# EAGLE design xtree (EAGLE 7.1.0)
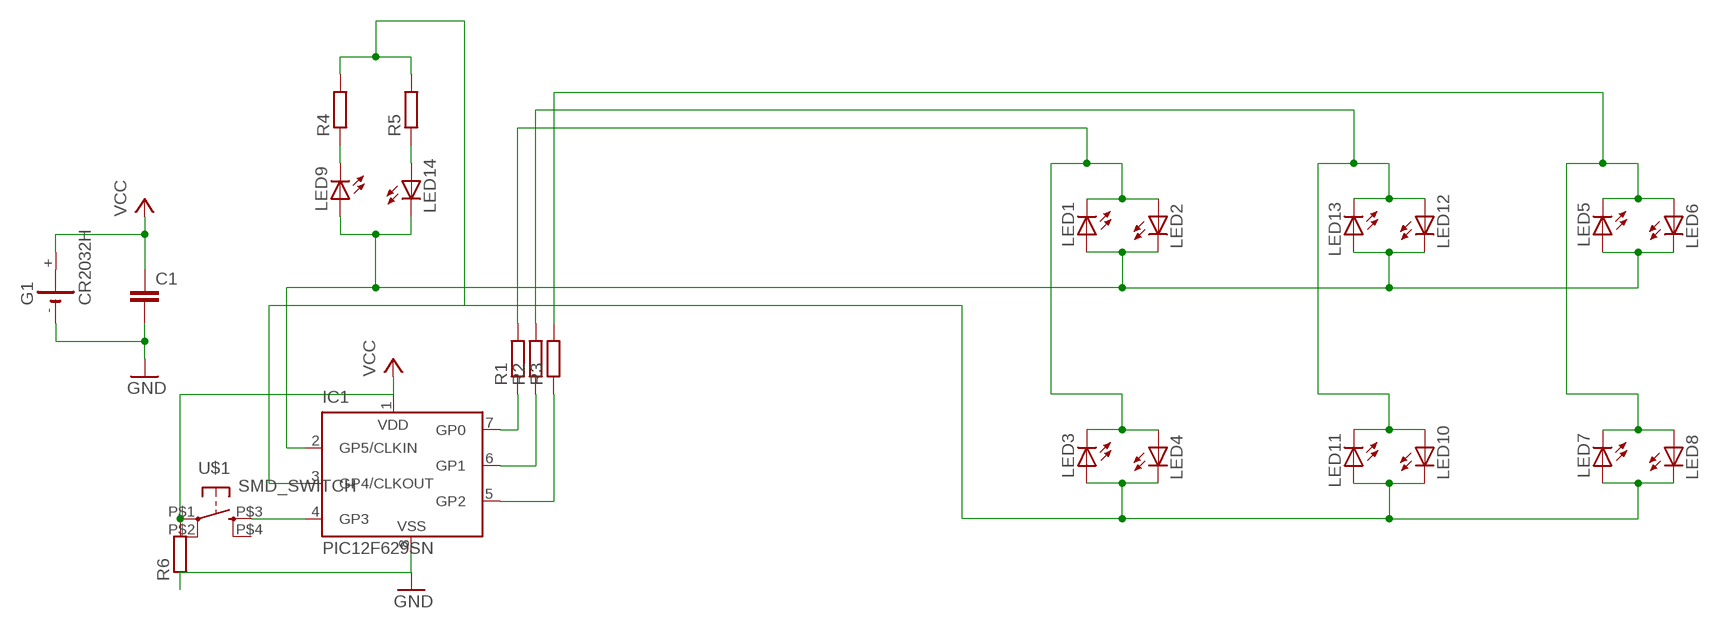
[diagram p0: schematic, sheet 1]

## Parts
C1  C-EUC1206K  [C1206K]
G1  CR2032H  [CR2032H]
IC1  PIC12F629SN  [SO-08]
LED1  LED_E  [LED_1206]
LED2  LED_E  [LED_1206]
LED3  LED_E  [LED_1206]
LED4  LED_E  [LED_1206]
LED5  LED_E  [LED_1206]
LED6  LED_E  [LED_1206]
LED7  LED_E  [LED_1206]
LED8  LED_E  [LED_1206]
LED9  LED_E  [LED_1206]
LED10  LED_E  [LED_1206]
LED11  LED_E  [LED_1206]
LED12  LED_E  [LED_1206]
LED13  LED_E  [LED_1206]
LED14  LED_E  [LED_1206]
R1  R-EU_R0603  [R0603]
R2  R-EU_R0603  [R0603]
R3  R-EU_R0603  [R0603]
R4  R-EU_R0603  [R0603]
R5  R-EU_R0603  [R0603]
R6  R-EU_R0603  [R0603]
U$1  SMD_SWITCH  [SMD_BUTTON]

## Nets
GND: C1.2 G1.- IC1.8(VSS) R6.1
N$1: LED1.C LED2.A LED3.C LED4.A R1.2
N$2: IC1.3(GP4/CLKOUT) LED3.A LED4.C LED7.A LED8.C LED10.C LED11.A R4.2 R5.2
N$3: IC1.7(GP0) R1.1
N$4: LED5.C LED6.A LED7.C LED8.A R3.2
N$5: LED10.A LED11.C LED12.A LED13.C R2.2
N$6: IC1.2(GP5/CLKIN) LED1.A LED2.C LED5.A LED6.C LED9.A LED12.C LED13.A LED14.C
N$7: IC1.6(GP1) R2.1
N$8: IC1.5(GP2) R3.1
N$9: IC1.4(GP3) U$1.P$3(S)
N$11: LED9.C R4.1
N$12: LED14.A R5.1
VCC: C1.1 G1.+ IC1.1(VDD) R6.2 U$1.P$1(P)
Unconnected: G1.+@1(+) U$1.P$2(P1) U$1.P$4(S1)

## Library data of the parts
C1 = rcl:C-EU: CAPACITOR, European symbol
G1 = battery:CR2032H: LI BATTERY Varta
IC1 = microchip:PIC12F6*: Data Sheet 8-Pin FLASH-Based 8-Bit CMOS Microcontrollers Source: http://www.microchip.com .. 41190c.pdf; MF: MICROCHIP; MPN: PIC12F629-I/SN; OC_FARNELL: 9759000; OC_NEWARK: 61K3433
LED1-LED14 = eagle-ltspice:LED_E: LED Source: http://www.osram.convergy.de Source: www.luxeon.com Source: www.kingbright.com; SPICEMODEL: NONE; SPICEPREFIX: D; SPICETYPE: diode
R1-R6 = rcl:R-EU_: RESISTOR, European symbol
U$1 = smd_button:SMD_SWITCH

## Board
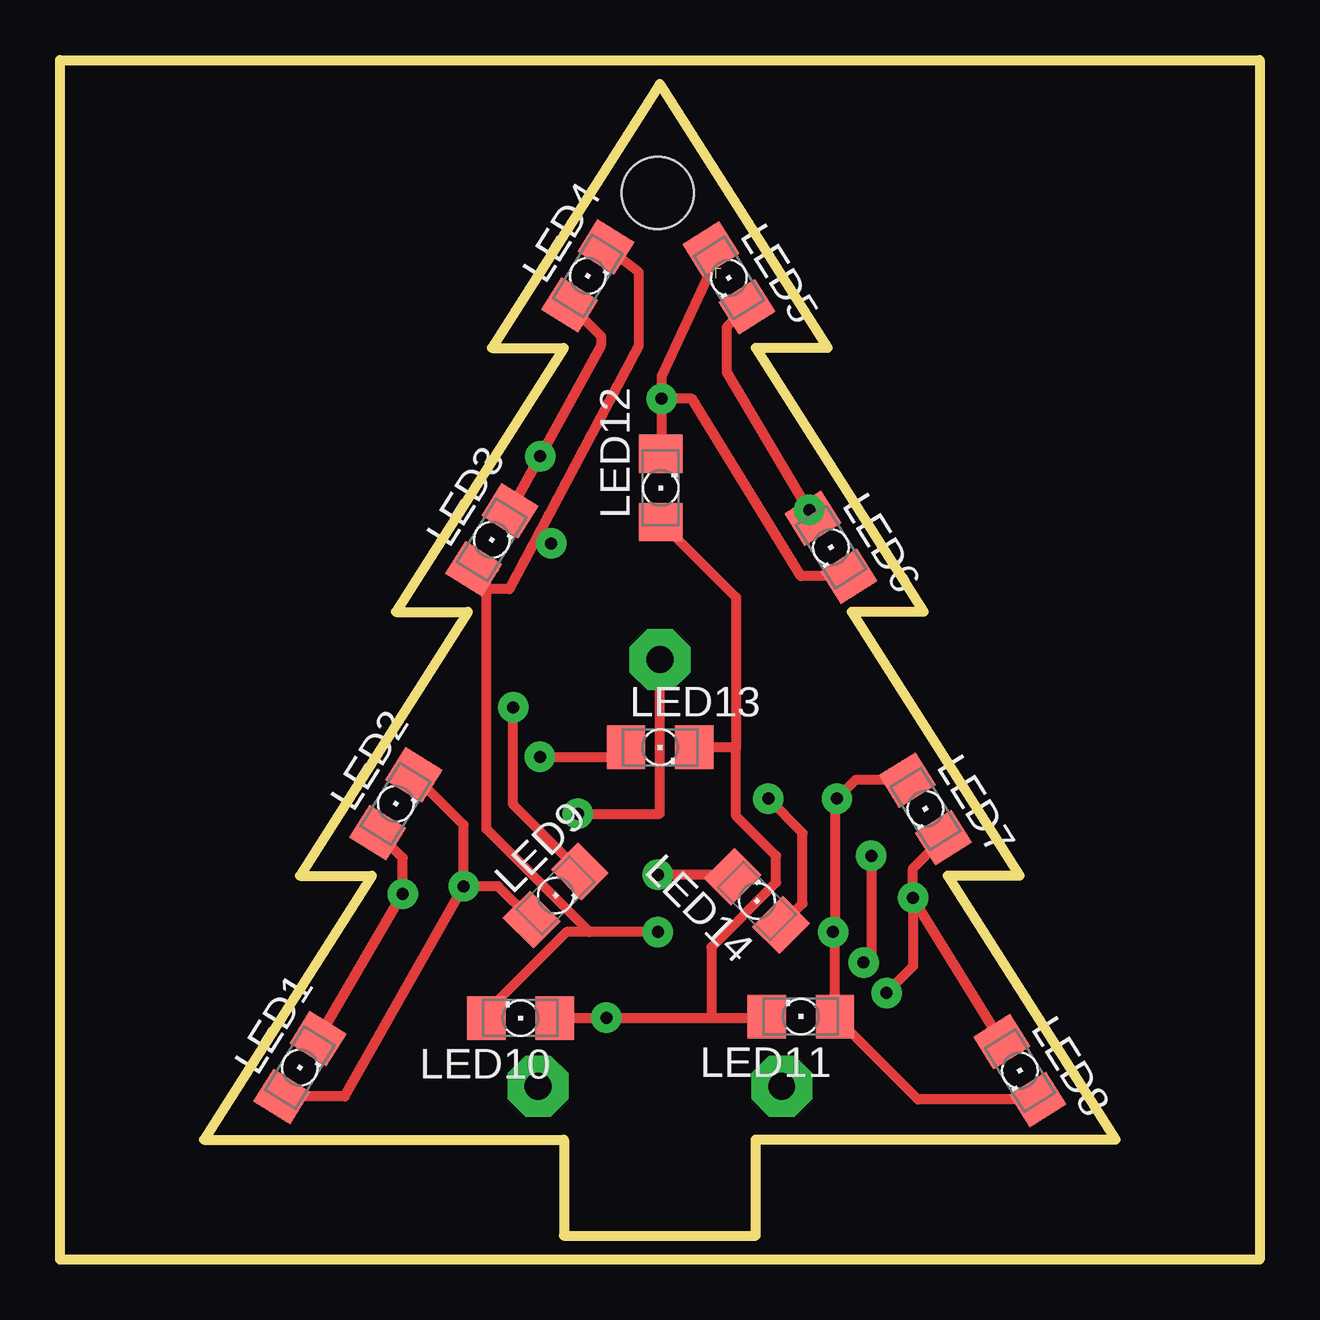
[diagram p1: board, top side]
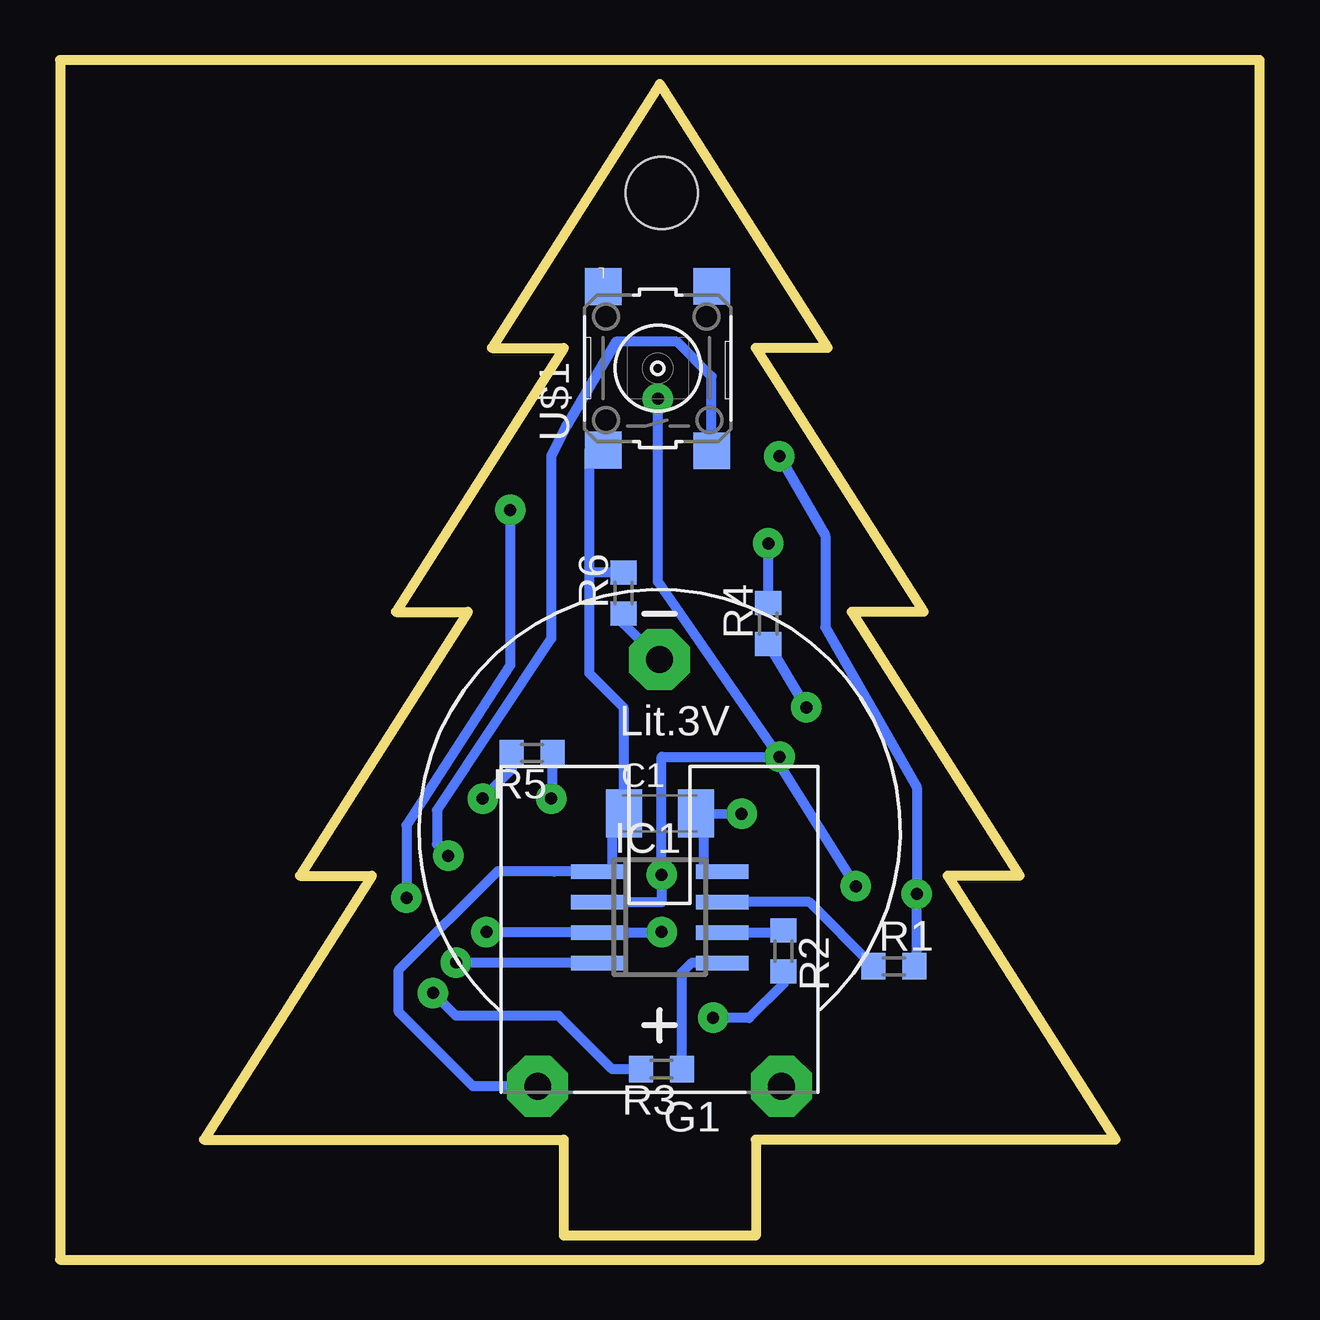
[diagram p2: board, bottom side, seen from below]

Size 50 x 50 mm. Coordinates in mm from the lower left corner, seen from the top.
Outline: 0,0 0,50 50,50 50,0 0,0
Outline: 18,38 21,38 14,27 17,27 10,16 13,16 6,5 21,5 21,1 29,1 29,5 44,5 37,16 40,16 33,27 36,27 29,38 32,38 25,49 18,38
Copper layers (1*16): Top 0.035mm / dielectric 1.5mm / Bottom 0.035mm
Design rules "default": minimum track width 10mil, minimum drill 24mil, track to track 8mil, track to pad 8mil, pad to pad 8mil, via to via 8mil, smd to smd 8mil, copper to edge 40mil, drill to drill 8mil, minimum pad ring 10mil, minimum via ring 8mil, stop-mask expansion 4mil, vias tented up to drill 0mil, thermal gap 10mil
Holes 3 mm at 24.92,44.45

### Footprints (pad centres in the part's own frame; a part is rotated, then mirrored left to right if it is on the bottom)
C1206K = smd 1.5 x 2: 1 -1.5,0; 2 1.5,0
CR2032H = drill 1.118 pad 2.54 octagon: + 5.08,10.795; +@1 -5.08,10.795; - 0,-6.985
SO-08 = smd 0.6 x 2.2: 1 -1.905,-2.6; 2 -0.635,-2.6; 3 0.635,-2.6; 4 1.905,-2.6; 5 1.905,2.6; 6 0.635,2.6; 7 -0.635,2.6; 8 -1.905,2.6
LED_1206 = smd 1.6 x 1.803: A -1.422,0; C 1.422,0
R0603 = smd 1 x 1.1: 1 -0.85,0; 2 0.85,0
SMD_BUTTON = smd 1.524 x 1.524: P$1 -3.407,2.272; P$2 3.406,2.266; P$3 -3.431,-2.244; P$4 3.412,-2.256

### Placement (x,y rotation side)
C1  25,18.59 0 bottom
G1  25.01,18.02 180 bottom
IC1  25,14.27 270 bottom
LED1  10,8 58 top
LED2  14,18.99 58 top
LED3  18,30 58 top
LED4  22,41 58 top
LED5  27.88,40.91 302 top
LED6  32.13,29.69 302 top
LED7  36.07,18.78 302 top
LED8  40.01,7.88 302 top
LED9  20.66,15.17 45 top
LED10  19.2,10.07 180 top
LED11  30.88,10.13 180 top
LED12  25.04,32.16 90 top
LED13  25.02,21.35 0 top
LED14  29.05,14.95 135 top
R1  15.24,12.22 0 bottom
R2  19.84,12.86 270 bottom
R3  24.92,7.94 180 bottom
R4  20.48,26.51 90 bottom
R5  30.32,21.11 180 bottom
R6  26.51,27.78 90 bottom
U$1  25.08,37.15 90 bottom

### Tracks (layer width: path | path; a pad name or v marks a point on that pad's centre or on a via)
GND  (via drill 0.5 pad 1.27)
  Top 0.406: G1.- 25.01,18.59 25,18.57 v21.59,18.57
  Bottom 0.406: IC1.8 23,16.17 23.18,16.35 23.18,18.26 C1.2 23.35,18.59 v21.59,18.57 | R6.1 26.51,26.51 G1.-
N$1  (via drill 0.5 pad 1.27)
  Top 0.406: LED4.A 22.54,38.5 22.54,38.1 LED3.C | LED1.C v14.29,15.24 14.29,16.74 LED2.A | LED3.C 18.88,31.34 18.88,31.53 | LED3.C v20.01,33.48
  Bottom 0.406: v20.02,33.49 19.95,33.37 | 19.95,33.37 18.1,30.16 18.1,26.35 14.29,19.68 v14.29,15.24 14.29,12.33 R1.2 | v20.01,33.48 19.95,33.37
N$2  (via drill 0.5 pad 1.27)
  Top 0.406: 17.25,28.26 LED3.A 18.1,28.79 | 17.25,28.26 17.25,28.16 | 19.9,30.13 18.73,27.94 17.78,27.94 | 19.9,30.13 24.13,38.1 24.13,41.15 LED4.C | LED8.C 35.76,6.67 LED11.A 32.3,13.73 | LED10.C 17.77,9.53 18.1,9.53 18.1,10.64 21.11,13.65 22.07,13.65 | 32.3,13.73 32.3,19.13 v32.38,19.21 33.18,20 35.3,20 LED7.A | 32.3,13.73 v32.23,13.65 | v24.92,13.65 22.07,13.65 | 22.07,13.65 17.78,17.94 17.78,27.94 | 17.78,27.94 17.78,28.26 17.25,28.26 | v20.48,29.84 19.9,30.13
  Bottom 0.406: v24.92,13.65 24.94,13.63 IC1.3 32.25,13.63 | 32.3,13.65 32.28,13.63 32.25,13.63 | 32.25,13.63 v32.23,13.65 | R4.2 v20.48,29.84 | v32.38,19.21 31.17,20.42 R5.2
N$3
  Bottom 0.406: R1.1 18.77,14.9 IC1.7
N$4  (via drill 0.5 pad 1.27)
  Top 0.406: LED5.C 27.78,38.86 27.78,36.99 LED6.A v31.23,31.24 | LED8.A v35.56,15.08 | v35.56,15.08 35.56,16.31 LED7.C | v35.56,15.08 35.56,12.22 v34.45,11.11
  Bottom 0.406: v31.23,31.24 31.23,24.77 35.56,18.1 v35.56,15.08 | R3.2 26.99,7.94 29.21,10.16 33.5,10.16 v34.45,11.11
N$5  (via drill 0.5 pad 1.27)
  Top 0.406: 26.44,20.64 LED13.C 28.18,21.35 | LED12.A 28.18,27.6 28.18,21.35 | 29.69,10.36 LED11.C 29.46,10.08 27.15,10.08 | 27.15,10.08 v22.77,10.08 22.77,10.07 LED10.A | 27.15,10.08 27.15,13.02 29.84,15.72 29.84,16.83 28.18,18.49 28.18,21.35
  Bottom 0.406: 22.77,10.07 v22.77,10.08 22.76,10.07 21.27,10.07 19.84,11.49 R2.2
N$6  (via drill 0.5 pad 1.27)
  Top 0.406: LED1.A 11.87,6.79 v16.83,15.56 | LED6.C 30.89,28.48 26.35,35.88 v25.08,35.88 | v16.83,15.56 16.83,18.12 LED2.C | LED5.A 26.99,40.96 25.08,36.83 v25.08,35.88 | v25.08,35.88 25.08,33.58 LED12.C 25.04,33.7 24.77,33.97 | 23.5,21.1 23.35,20.95 LED13.A 23.59,20.95 v20,20.95 | LED14.C 27.97,16.03 v24.92,16.03 | LED9.A 18.27,15.56 v16.83,15.56
  Bottom 0.406: v16.83,15.56 20,20.64 v20,20.95 | v25.08,35.88 25.08,28.26 v20,20.95 | IC1.2 24.92,14.9 v24.92,16.03 24.92,20.95 v20,20.95
N$7
  Bottom 0.406: IC1.6 19.84,13.63 R2.1
N$8
  Bottom 0.406: IC1.5 22.42,12.38 23.65,12.38 24.07,11.96 R3.1
N$9  (via drill 0.5 pad 1.27)
  Top 0.406: v33.81,16.83 33.81,12.7 v33.5,12.38
  Bottom 0.406: U$1.P$3 22.84,36.81 24.29,38.26 26.83,38.26 28.89,34.77 29.53,33.5 29.53,25.88 34.29,18.73 34.29,17.3 v33.81,16.83 | v33.5,12.38 27.62,12.38 IC1.4
N$11  (via drill 0.5 pad 1.27)
  Top 0.406: LED9.C 18.89,18.96 v18.89,23.02
  Bottom 0.406: v18.89,23.02 R4.1
N$12  (via drill 0.5 pad 1.27)
  Top 0.406: LED14.A 30.96,14.84 30.96,17.78 v29.53,19.21
  Bottom 0.406: v29.53,19.21 29.47,19.27 R5.1
VCC
  Bottom 0.406: G1.+ 32.78,7.22 35.88,10.32 35.88,12.06 31.75,16.19 29.41,16.19 29.39,16.17 IC1.1 27.01,16.17 26.99,16.19 26.99,18.1 C1.1 26.51,23.02 27.94,24.45 27.94,28.63 | R6.2 27.94,28.63 | U$1.P$1 27.94,33.74 27.94,28.63